# EAGLE design main (EAGLE 6.6.0)
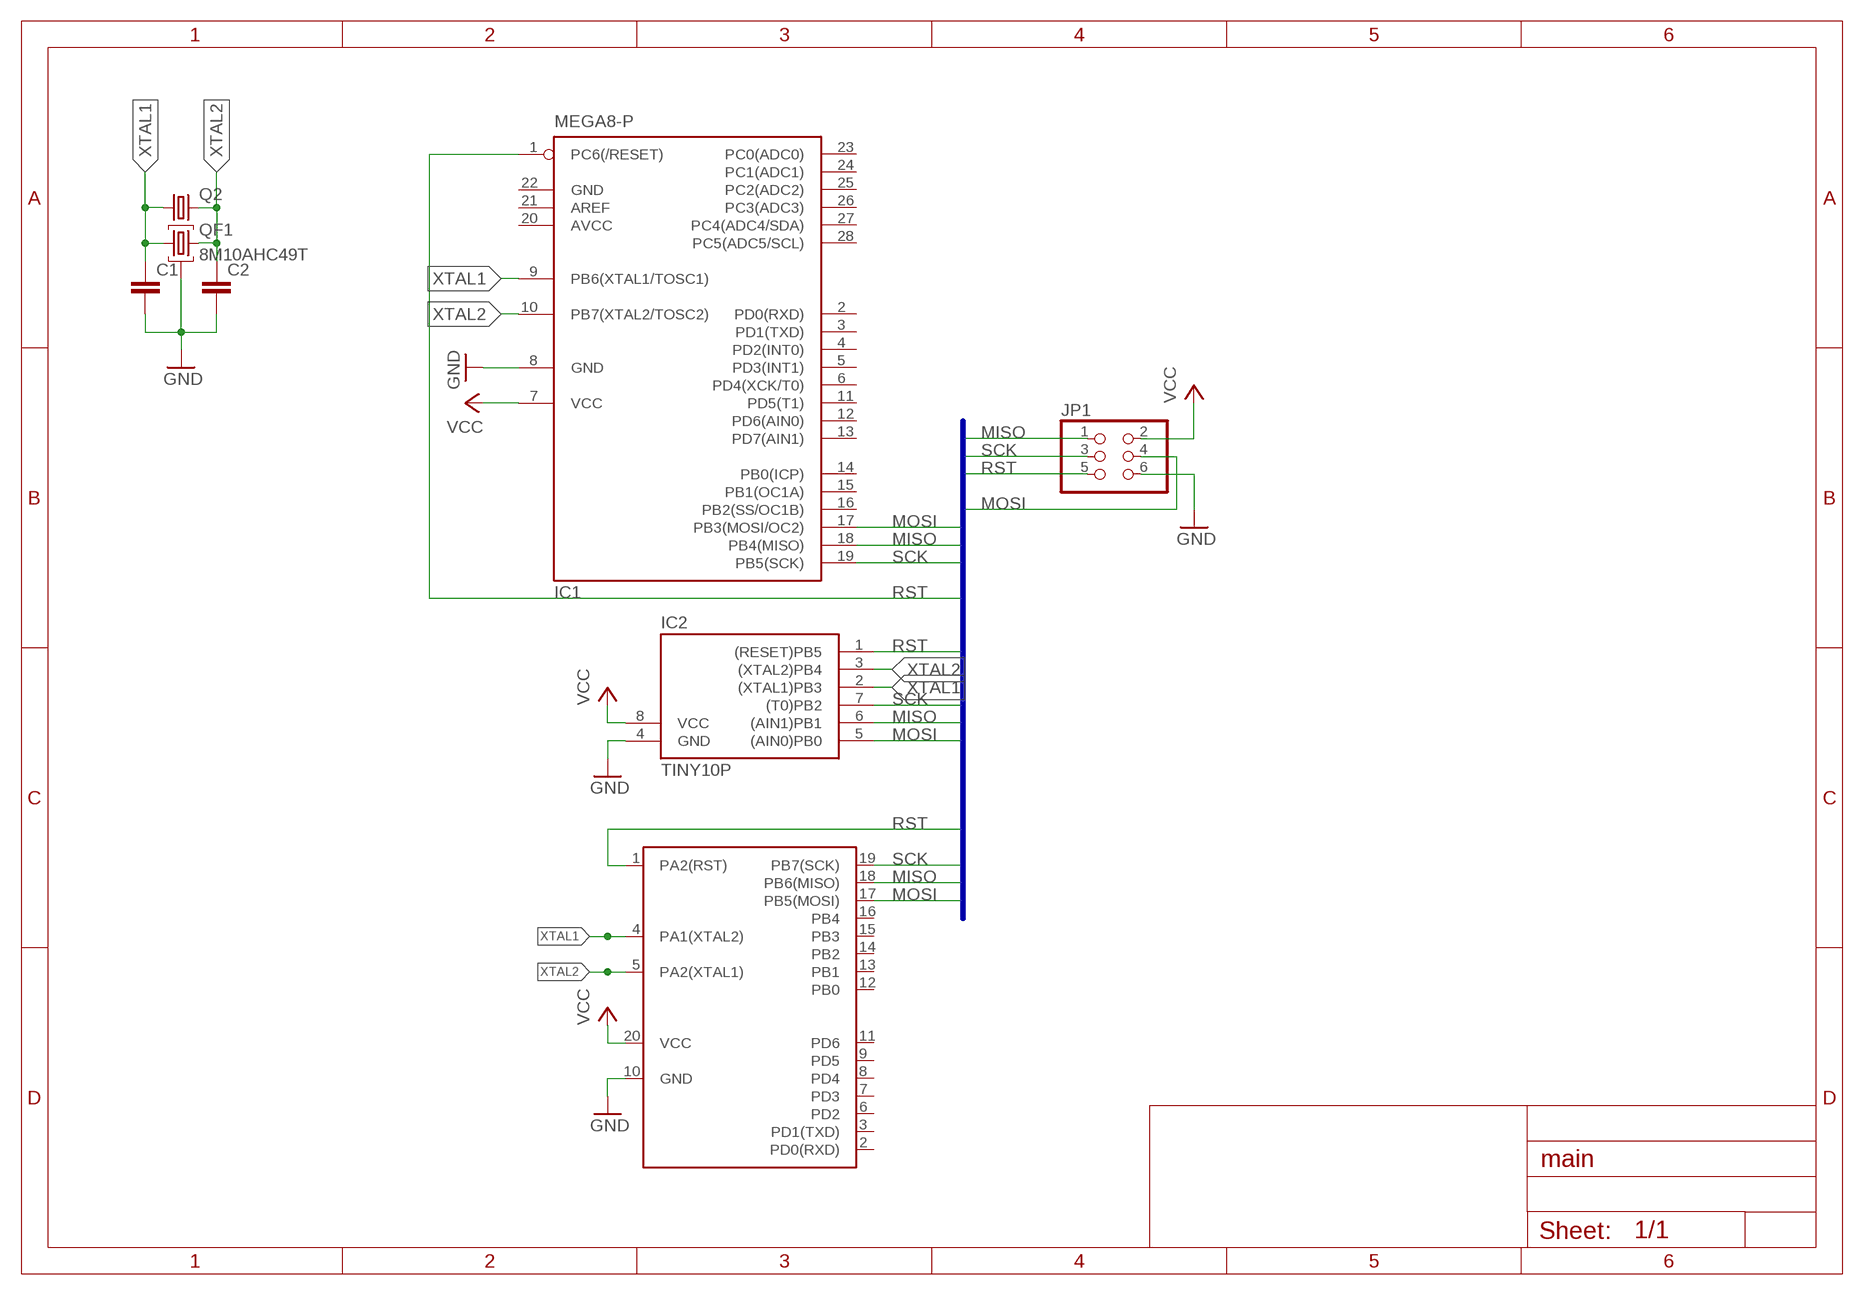
[diagram p0: schematic, sheet 1]

## Parts
C1  C-EUC0603K  [C0603K]
C2  C-EUC0603K  [C0603K]
IC1  MEGA8-P  [DIL28-3]
IC2  TINY10P  [DIL08]
JP1  PINHD-2X3  [2X03]
Q2  CRYSTALHC18U-V  [HC18U-V]
QF1  8M10AHC49T  [HC49U]
U$1  TINY2313  [DIL20]

## Nets
GND: C1.2 C2.2 IC1.8(GND) IC2.4(GND) JP1.6 QF1.2 U$1.10(GND)
MISO: IC1.18(PB4(MISO)) IC2.6((AIN1)PB1) JP1.1 U$1.18(PB6(MISO))
MOSI: IC1.17(PB3(MOSI/OC2)) IC2.5((AIN0)PB0) JP1.4 U$1.17(PB5(MOSI))
RST: IC1.1(PC6(/RESET)) IC2.1((RESET)PB5) JP1.5 U$1.1(PA2(RST))
SCK: IC1.19(PB5(SCK)) IC2.7((T0)PB2) JP1.3 U$1.19(PB7(SCK))
VCC: IC1.7(VCC) IC2.8(VCC) JP1.2 U$1.20(VCC)
XTAL1: C1.1 IC1.9(PB6(XTAL1/TOSC1)) IC2.2((XTAL1)PB3) Q2.1 QF1.1 U$1.4(PA1(XTAL2))
XTAL2: C2.1 IC1.10(PB7(XTAL2/TOSC2)) IC2.3((XTAL2)PB4) Q2.2 QF1.3 U$1.5(PA2(XTAL1))
Unconnected: IC1.2(PD0(RXD)) IC1.3(PD1(TXD)) IC1.4(PD2(INT0)) IC1.5(PD3(INT1)) IC1.6(PD4(XCK/T0)) IC1.11(PD5(T1)) IC1.12(PD6(AIN0)) IC1.13(PD7(AIN1)) IC1.14(PB0(ICP)) IC1.15(PB1(OC1A)) IC1.16(PB2(SS/OC1B)) IC1.21(AREF) IC1.23(PC0(ADC0)) IC1.24(PC1(ADC1)) IC1.25(PC2(ADC2)) IC1.26(PC3(ADC3)) IC1.27(PC4(ADC4/SDA)) IC1.28(PC5(ADC5/SCL)) U$1.2(PD0(RXD)) U$1.3(PD1(TXD)) U$1.6(PD2) U$1.7(PD3) U$1.8(PD4) U$1.9(PD5) U$1.11(PD6) U$1.12(PB0) U$1.13(PB1) U$1.14(PB2) U$1.15(PB3) U$1.16(PB4)

## Buses
ISP:MISO,SCK,MOSI,RST

## Power pins joined to a net without a drawn wire
AVCC: IC1.20(AVCC)
GND: IC1.22(GND)

## Library data of the parts
C1 C2 = rcl:C-EU: CAPACITOR, European symbol
IC1 = atmel:MEGA8-P: MICROCONTROLLER 8 Kbytes FLASH, 1 kbytes SRAM, 512 bytes EEPROM, USART, 4-channel 10 bit ADC, 2-channel 8 bit ADC Pin compatible with Atmega48, ATMega88, ATMega168 Source: avr.lbr; OC_FARNELL: unknown; OC_NEWARK: unknown
IC2 = atmel:TINY10: MICROCONTROLLER 1 Kbytes ROM; OC_FARNELL: unknown; OC_NEWARK: unknown
JP1 = pinhead:PINHD-2X3: PIN HEADER
Q2 = crystal:CRYSTAL: CRYSTAL; OC_FARNELL: unknown; OC_NEWARK: unknown
QF1 = crystal:8M10AHC49T: Monolithic Crystal Filters Source: www.vanlong.com; OC_FARNELL: unknown; OC_NEWARK: unknown
U$1 = atmel:TINY2313

## Board
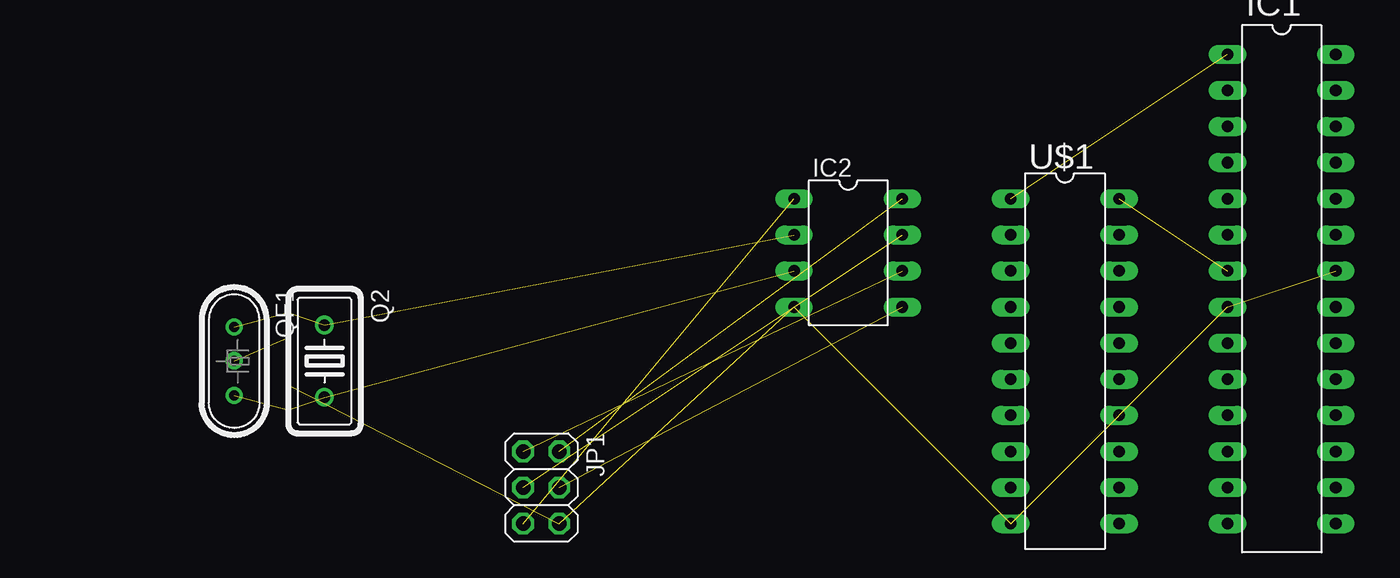
[diagram p1: board, top side]
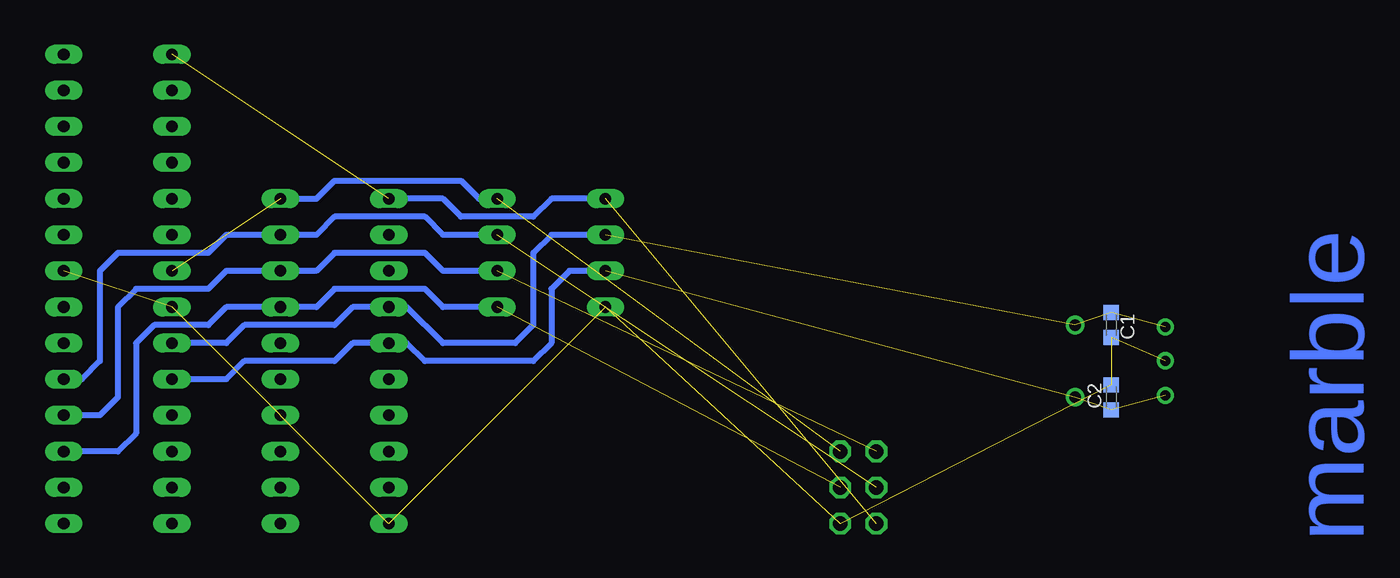
[diagram p2: board, bottom side, seen from below]

No outline drawn. Coordinates in mm, seen from the top.
Copper layers (1*16): Top 0.035mm / dielectric 1.5mm / Bottom 0.035mm
Design rules "default *": minimum track width 10mil, minimum drill 24mil, track to track 8mil, track to pad 8mil, pad to pad 8mil, via to via 8mil, smd to smd 8mil, copper to edge 40mil, drill to drill 8mil, minimum pad ring 10mil, minimum via ring 15mil, stop-mask expansion 4mil, vias tented up to drill 0mil, thermal gap 10mil

### Footprints (pad centres in the part's own frame; a part is rotated, then mirrored left to right if it is on the bottom)
C0603K = smd 1.05 x 1.08: 1 -0.875,0; 2 0.875,0
DIL28-3 = drill 0.813 long: 1 -16.51,-3.81; 2 -13.97,-3.81; 3 -11.43,-3.81; 4 -8.89,-3.81; 5 -6.35,-3.81; 6 -3.81,-3.81; 7 -1.27,-3.81; 8 1.27,-3.81; 9 3.81,-3.81; 10 6.35,-3.81; 11 8.89,-3.81; 12 11.43,-3.81; 13 13.97,-3.81; 14 16.51,-3.81; 15 16.51,3.81; 16 13.97,3.81; 17 11.43,3.81; 18 8.89,3.81; 19 6.35,3.81; 20 3.81,3.81; 21 1.27,3.81; 22 -1.27,3.81; 23 -3.81,3.81; 24 -6.35,3.81; 25 -8.89,3.81; 26 -11.43,3.81; 27 -13.97,3.81; 28 -16.51,3.81
DIL08 = drill 0.813 long: 1 -3.81,-3.81; 2 -1.27,-3.81; 3 1.27,-3.81; 4 3.81,-3.81; 5 3.81,3.81; 6 1.27,3.81; 7 -1.27,3.81; 8 -3.81,3.81
2X03 = drill 1.016 octagon: 1 -2.54,-1.27; 2 -2.54,1.27; 3 0,-1.27; 4 0,1.27; 5 2.54,-1.27; 6 2.54,1.27
HC18U-V = drill 0.813: 1 -2.54,0; 2 2.54,0
HC49U = drill 0.7 pad 1.2: 1 -2.413,0; 2 -0.027,0; 3 2.413,0
DIL20 = drill 0.813 long: 1 -11.43,-3.81; 2 -8.89,-3.81; 3 -6.35,-3.81; 4 -3.81,-3.81; 5 -1.27,-3.81; 6 1.27,-3.81; 7 3.81,-3.81; 8 6.35,-3.81; 9 8.89,-3.81; 10 11.43,-3.81; 11 11.43,3.81; 12 8.89,3.81; 13 6.35,3.81; 14 3.81,3.81; 15 1.27,3.81; 16 -1.27,3.81; 17 -3.81,3.81; 18 -6.35,3.81; 19 -8.89,3.81; 20 -11.43,3.81

### Placement (x,y rotation side)
C1  5.08,31.75 270 bottom
C2  5.08,26.67 90 bottom
IC1  74.93,34.29 270 top
IC2  44.45,36.83 270 top
JP1  22.86,20.32 270 top
Q2  7.62,29.21 270 top
QF1  1.27,29.21 270 top
U$1  59.69,29.21 270 top

### Tracks (layer width: path | path; a pad name or v marks a point on that pad's centre or on a via)
GND  (7 unrouted)
MISO  (1 unrouted)
  Bottom 0.406: IC2.6 52.07,35.56 53.34,36.83 59.69,36.83 60.96,35.56 U$1.18 67.31,35.56 68.58,34.29 73.66,34.29 74.93,33.02 74.93,26.67 76.2,25.4 IC1.18
MOSI  (1 unrouted)
  Bottom 0.406: IC2.5 52.07,33.02 53.34,34.29 59.69,34.29 60.96,33.02 U$1.17 67.31,33.02 68.58,31.75 72.39,31.75 73.66,30.48 73.66,24.13 74.93,22.86 IC1.17
N$1
  cutout Bottom: -13.97,41.91 -6.35,41.91 -6.35,15.24 -13.97,15.24
RST  (2 unrouted)
  Bottom 0.406: IC2.1 44.45,40.64 45.72,39.37 50.8,39.37 52.07,40.64 U$1.1
SCK  (1 unrouted)
  Bottom 0.406: IC2.7 52.07,38.1 53.34,39.37 59.69,39.37 60.96,38.1 U$1.19 67.31,38.1 68.58,36.83 74.93,36.83 76.2,35.56 76.2,29.21 77.47,27.94 IC1.19
VCC  (2 unrouted)
  Bottom 0.406: U$1.20 60.96,40.64 59.69,41.91 50.8,41.91 49.53,40.64 IC2.8
XTAL1  (3 unrouted)
  Bottom 0.406: IC2.2 44.45,38.1 45.72,36.83 45.72,31.75 46.99,30.48 52.07,30.48 54.61,33.02 U$1.4 58.42,33.02 59.69,31.75 66.04,31.75 67.31,30.48 IC1.9
XTAL2  (3 unrouted)
  Bottom 0.406: IC2.3 43.18,35.56 44.45,34.29 44.45,30.48 45.72,29.21 53.34,29.21 54.61,30.48 U$1.5 58.42,30.48 59.69,29.21 66.04,29.21 67.31,27.94 IC1.10

### Text on the board
Bottom: marble